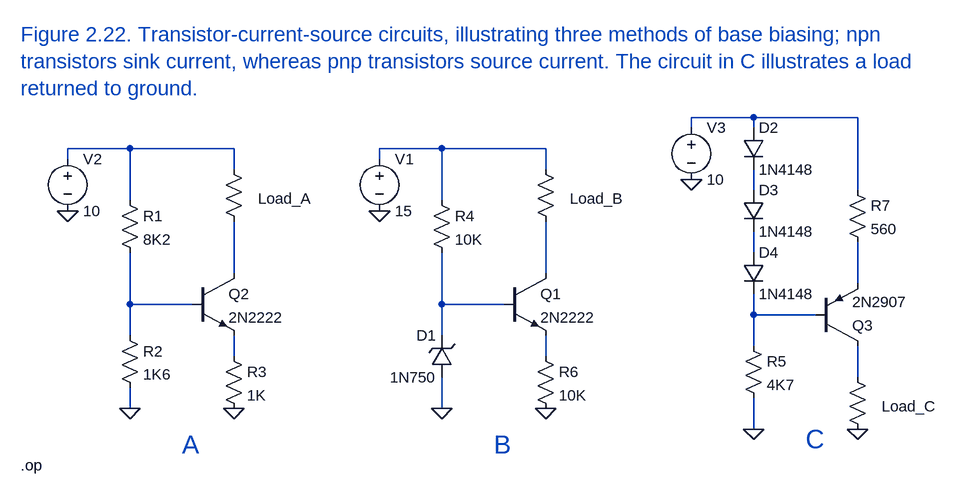
[diagram p0: schematic 02_22 - Transistor current-source circuits.asc]
02_22 - Transistor current-source circuits.asc, the LTspice schematic file:
Version 4
SHEET 1 940 852
WIRE 112 -32 16 -32
WIRE 240 -32 112 -32
WIRE 272 -32 240 -32
WIRE 16 -16 16 -32
WIRE 112 -16 112 -32
WIRE -848 16 -944 16
WIRE -688 16 -848 16
WIRE -368 16 -464 16
WIRE -208 16 -368 16
WIRE -944 32 -944 16
WIRE -464 32 -464 16
WIRE -688 48 -688 16
WIRE -208 48 -208 16
WIRE 112 80 112 48
WIRE 272 80 272 -32
WIRE -848 96 -848 16
WIRE -368 96 -368 16
WIRE -688 160 -688 128
WIRE -208 160 -208 128
WIRE 112 176 112 144
WIRE -688 208 -688 160
WIRE -208 208 -208 160
WIRE 272 224 272 160
WIRE -848 256 -848 176
WIRE -752 256 -848 256
WIRE -368 256 -368 176
WIRE -304 256 -368 256
WIRE -272 256 -304 256
WIRE 112 272 112 240
WIRE 176 272 112 272
WIRE 208 272 176 272
WIRE -848 304 -848 256
WIRE -368 304 -368 256
WIRE 112 320 112 272
WIRE -688 336 -688 304
WIRE -208 336 -208 304
WIRE 272 352 272 320
WIRE 272 368 272 352
WIRE -848 416 -848 384
WIRE -368 416 -368 368
WIRE 112 448 112 400
FLAG -944 112 0
FLAG -848 416 0
FLAG -688 416 0
FLAG -464 112 0
FLAG -368 416 0
FLAG -208 416 0
FLAG 16 64 0
FLAG 112 448 0
FLAG 272 448 0
DATAFLAG -688 160 "round(I(Load_a)*1K)/1K"
DATAFLAG -304 256 "round($*10)/10"
DATAFLAG -208 160 "round(I(Load_b)*10K)/10K"
DATAFLAG 240 -32 ""
DATAFLAG 272 352 "round(I(Load_c)*10K)/10K"
DATAFLAG 176 272 "round($*10)/10"
SYMBOL res -864 80 R0
SYMATTR InstName R1
SYMATTR Value 8K2
SYMBOL res -864 288 R0
SYMATTR InstName R2
SYMATTR Value 1K6
SYMBOL voltage -944 16 R0
WINDOW 123 0 0 Left 2
WINDOW 39 0 0 Left 2
SYMATTR InstName V2
SYMATTR Value 10
SYMBOL npn -752 208 R0
SYMATTR InstName Q2
SYMATTR Value 2N2222
SYMBOL res -704 320 R0
SYMATTR InstName R3
SYMATTR Value 1K
SYMBOL res -704 32 R0
WINDOW 0 53 61 Left 2
WINDOW 3 36 76 Invisible 2
SYMATTR InstName Load_A
SYMATTR Value 1
SYMBOL res -384 80 R0
SYMATTR InstName R4
SYMATTR Value 10K
SYMBOL voltage -464 16 R0
WINDOW 123 0 0 Left 2
WINDOW 39 0 0 Left 2
SYMATTR InstName V1
SYMATTR Value 15
SYMBOL npn -272 208 R0
SYMATTR InstName Q1
SYMATTR Value 2N2222
SYMBOL res -224 320 R0
SYMATTR InstName R6
SYMATTR Value 10K
SYMBOL res -224 32 R0
WINDOW 0 53 61 Left 2
WINDOW 3 36 76 Invisible 2
SYMATTR InstName Load_B
SYMATTR Value 1
SYMBOL zener -352 368 R180
WINDOW 0 24 64 Left 2
WINDOW 3 24 0 Left 2
SYMATTR InstName D1
SYMATTR Value 1N750
SYMATTR Description Diode
SYMATTR Type diode
SYMBOL voltage 16 -32 R0
WINDOW 123 0 0 Left 2
WINDOW 39 0 0 Left 2
SYMATTR InstName V3
SYMATTR Value 10
SYMBOL res 96 304 R0
SYMATTR InstName R5
SYMATTR Value 4K7
SYMBOL diode 96 -16 R0
SYMATTR InstName D2
SYMATTR Value 1N4148
SYMBOL res 256 352 R0
WINDOW 0 53 61 Left 2
WINDOW 3 36 76 Invisible 2
SYMATTR InstName Load_C
SYMATTR Value 1
SYMBOL res 256 64 R0
SYMATTR InstName R7
SYMATTR Value 560
SYMBOL diode 96 80 R0
SYMATTR InstName D3
SYMATTR Value 1N4148
SYMBOL diode 96 176 R0
SYMATTR InstName D4
SYMATTR Value 1N4148
SYMBOL pnp 208 320 M180
SYMATTR InstName Q3
SYMATTR Value 2N2907
TEXT -1016 504 Left 2 !.op
TEXT -1016 -160 Left 3 ;Figure 2.22. Transistor-current-source circuits, illustrating three methods of base biasing; npn\ntransistors sink current, whereas pnp transistors source current. The circuit in C illustrates a load\nreturned to ground.
TEXT -768 472 Left 4 ;A
TEXT -288 472 Left 4 ;B
TEXT 192 464 Left 4 ;C

The netlist it stands for:
* 02_22 - Transistor current-source circuits.asc
R1 N002 N009 8K2
R2 N009 0 1K6
V2 N002 0 10
Q2 N005 N009 N012 0 2N2222
R3 N012 0 1K
R§Load_A N002 N005 1
R4 N003 N010 10K
V1 N003 0 15
Q1 N006 N010 N013 0 2N2222
R6 N013 0 10K
R§Load_B N003 N006 1
D1 0 N010 1N750
V3 N001 0 10
R5 N011 0 4K7
D2 N001 N004 1N4148
R§Load_C N014 0 1
R7 N001 N008 560
D3 N004 N007 1N4148
D4 N007 N011 1N4148
Q3 N014 N011 N008 0 2N2907
.model D D
.lib standard.dio
.model NPN NPN
.model PNP PNP
.lib standard.bjt
.op
* Figure 2.22. Transistor-current-source circuits, illustrating three methods of base biasing; npn
* transistors sink current, whereas pnp transistors source current. The circuit in C illustrates a load
* returned to ground.
* A
* B
* C
.backanno
.end